# Altium schematic sheet MEMC_Plug_FFC.SchDoc
size A3; SheetNumber: 1; SheetTotal: 1
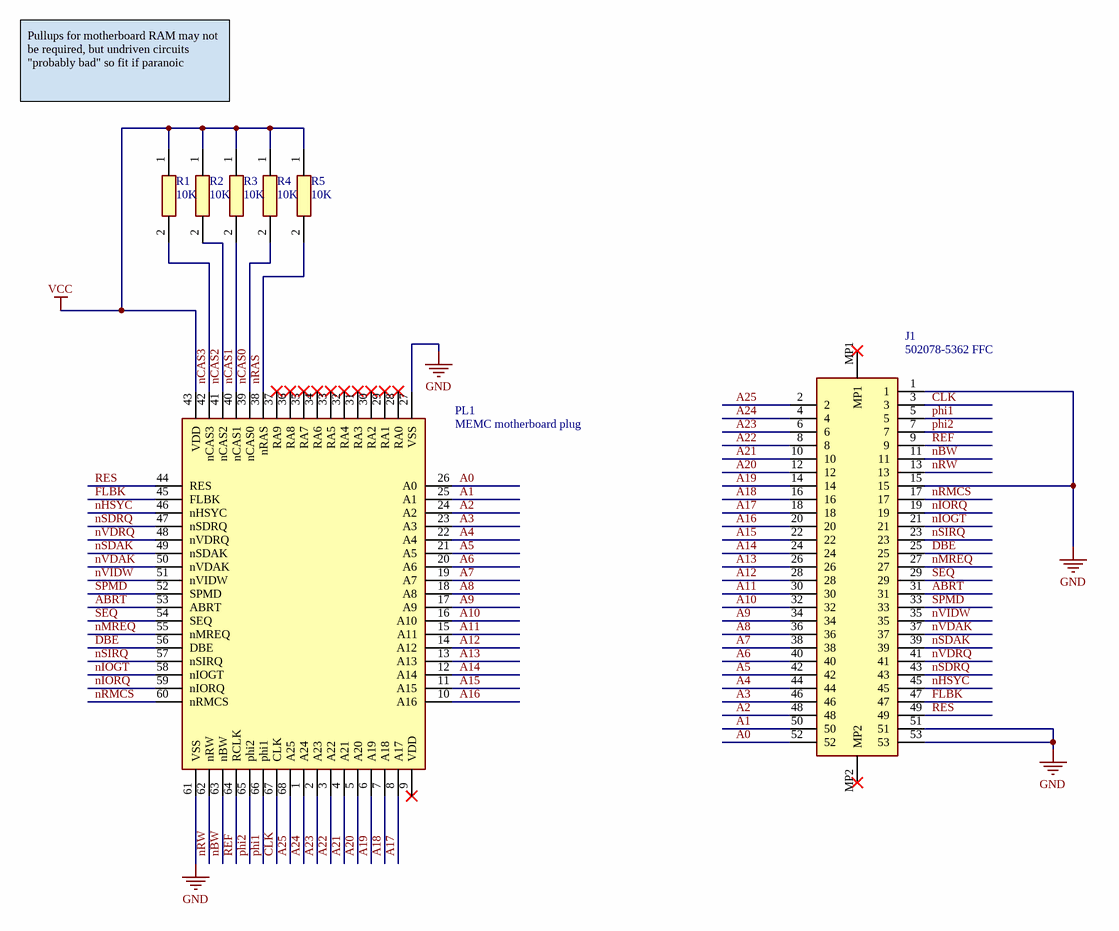
[diagram p0: MEMC_Plug_FFC.SchDoc]

## Parts
J1  502078-5362 FFC  [5020785362]
PL1  MEMC motherboard plug  [MEMC_Plug]
R1  10K  [RESC1005X40N]
R2  10K  [RESC1005X40N]
R3  10K  [RESC1005X40N]
R4  10K  [RESC1005X40N]
R5  10K  [RESC1005X40N]

## Nets
GND: J1.1 J1.15 J1.51 J1.53 PL1.27(VSS) PL1.61(VSS)
VCC: PL1.43(VDD) R1.1 R2.1 R3.1 R4.1 R5.1
A0: J1.52 PL1.26(A0)
A1: J1.50 PL1.25(A1)
A2: J1.48 PL1.24(A2)
A3: J1.46 PL1.23(A3)
A4: J1.44 PL1.22(A4)
A5: J1.42 PL1.21(A5)
A6: J1.40 PL1.20(A6)
A7: J1.38 PL1.19(A7)
A8: J1.36 PL1.18(A8)
A9: J1.34 PL1.17(A9)
A10: J1.32 PL1.16(A10)
A11: J1.30 PL1.15(A11)
A12: J1.28 PL1.14(A12)
A13: J1.26 PL1.13(A13)
A14: J1.24 PL1.12(A14)
A15: J1.22 PL1.11(A15)
A16: J1.20 PL1.10(A16)
A17: J1.18 PL1.8(A17)
A18: J1.16 PL1.7(A18)
A19: J1.14 PL1.6(A19)
A20: J1.12 PL1.5(A20)
A21: J1.10 PL1.4(A21)
A22: J1.8 PL1.3(A22)
A23: J1.6 PL1.2(A23)
A24: J1.4 PL1.1(A24)
A25: J1.2 PL1.68(A25)
ABRT: J1.31 PL1.53(ABRT)
CLK: J1.3 PL1.67(CLK)
DBE: J1.25 PL1.56(DBE)
FLBK: J1.47 PL1.45(FLBK)
nBW: J1.11 PL1.63(nBW)
nCAS0: PL1.39(nCAS0) R4.2
nCAS1: PL1.40(nCAS1) R3.2
nCAS2: PL1.41(nCAS2) R2.2
nCAS3: PL1.42(nCAS3) R1.2
nHSYC: J1.45 PL1.46(nHSYC)
nIOGT: J1.21 PL1.58(nIOGT)
nIORQ: J1.19 PL1.59(nIORQ)
nMREQ: J1.27 PL1.55(nMREQ)
nRAS: PL1.38(nRAS) R5.2
nRMCS: J1.17 PL1.60(nRMCS)
nRW: J1.13 PL1.62(nRW)
nSDAK: J1.39 PL1.49(nSDAK)
nSDRQ: J1.43 PL1.47(nSDRQ)
nSIRQ: J1.23 PL1.57(nSIRQ)
nVDAK: J1.37 PL1.50(nVDAK)
nVDRQ: J1.41 PL1.48(nVDRQ)
nVIDW: J1.35 PL1.51(nVIDW)
phi1: J1.5 PL1.66(phi1)
phi2: J1.7 PL1.65(phi2)
REF: J1.9 PL1.64(RCLK)
RES: J1.49 PL1.44(RES)
SEQ: J1.29 PL1.54(SEQ)
SPMD: J1.33 PL1.52(SPMD)

Not connected (* = marked no-connect by the designer): J1 MP1* MP2*; PL1 9(VDD)* 28(RA0)* 29(RA1)* 30(RA2)* 31(RA3)* 32(RA4)* 33(RA5)* 34(RA6)* 35(RA7)* 36(RA8)* 37(RA9)*

## Notes on the sheet
- Pullups for motherboard RAM may not be required, but undriven circuits "probably bad" so fit if paranoic
- SIZE
- CODION LTD
- DIMENSIONS
- TITLE
- VARIANT
- REVISION
- DATE
- A3
- SHEET
- OF
- FILE
- DRAWN BY

## Library data of the parts
J1 = 502078-5362: Connector; Manufacturer_Name: Molex; Datasheet Link: https://componentsearchengine.com/Datasheets/1/502078-5362.pdf; Height: 1.15mm; Manufacturer_Part_Number: 502078-5362; Mouser Part Number: 538-502078-5362; Mouser Price/Stock: https://www.mouser.com/Search/Refine.aspx?Keyword=538-502078-5362
PL1 = MEMC_Plug: MEMC plug
R1-R5 = CRCW040210K0FKEDHP: Resistor; Manufacturer_Name: Vishay; Datasheet Link: http://www.vishay.com/docs/20035/dcrcwe3.pdf; Height: 0.4mm; Manufacturer_Part_Number: CRCW040210K0FKEDHP; Mouser Part Number: 71-CRCW040210K0FKEDH; Mouser Price/Stock: https://www.mouser.co.uk/ProductDetail/Vishay-Dale/CRCW040210K0FKEDHP?qs=FlFvgi4rxBxmIiaeyFjrkA%3D%3D; Arrow Part Number: CRCW040210K0FKEDHP; Arrow Price/Stock: https://www.arrow.com/en/products/crcw040210k0fkedhp/vishay?region=nac